# EAGLE design Placa de Cima (EAGLE 9.3.0)
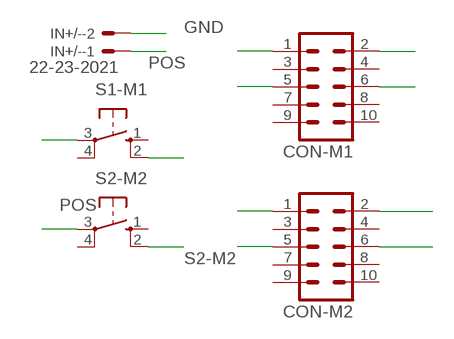
[diagram p0: schematic, sheet 1]

## Parts
CON-M1  MA05-2  [MA05-2]
CON-M2  MA05-2  [MA05-2]
IN+/-  22-23-2021  [22-23-2021]
S1-M1  10-XX  [B3F-10XX]
S2-M2  10-XX  [B3F-10XX]

## Nets
GND: CON-M1.5 CON-M1.6 CON-M2.5 CON-M2.6 IN+/-.2
POS: IN+/-.1 S1-M1.3(P) S2-M2.3(P)
S1-M1: CON-M1.1 CON-M1.2 S1-M1.2(S1)
S2-M2: CON-M2.1 CON-M2.2 S2-M2.2(S1)
Unconnected: CON-M1.3 CON-M1.4 CON-M1.7 CON-M1.8 CON-M1.9 CON-M1.10 CON-M2.3 CON-M2.4 CON-M2.7 CON-M2.8 CON-M2.9 CON-M2.10 S1-M1.1(S) S1-M1.4(P1) S2-M2.1(S) S2-M2.4(P1)

## Library data of the parts
CON-M1 CON-M2 = con-lstb:MA05-2: PIN HEADER; OC_FARNELL: unknown; OC_NEWARK: unknown
IN+/- = con-molex:22-23-2021: .100" (2.54mm) Center Header - 2 Pin; MF: MOLEX; MPN: 22-23-2021; OC_FARNELL: 1462926; OC_NEWARK: 25C3832
S1-M1 S2-M2 = switch-omron:10-XX: OMRON SWITCH; MPN: B3F-1000; OC_FARNELL: 176432; OC_NEWARK: 36M3542

## Board
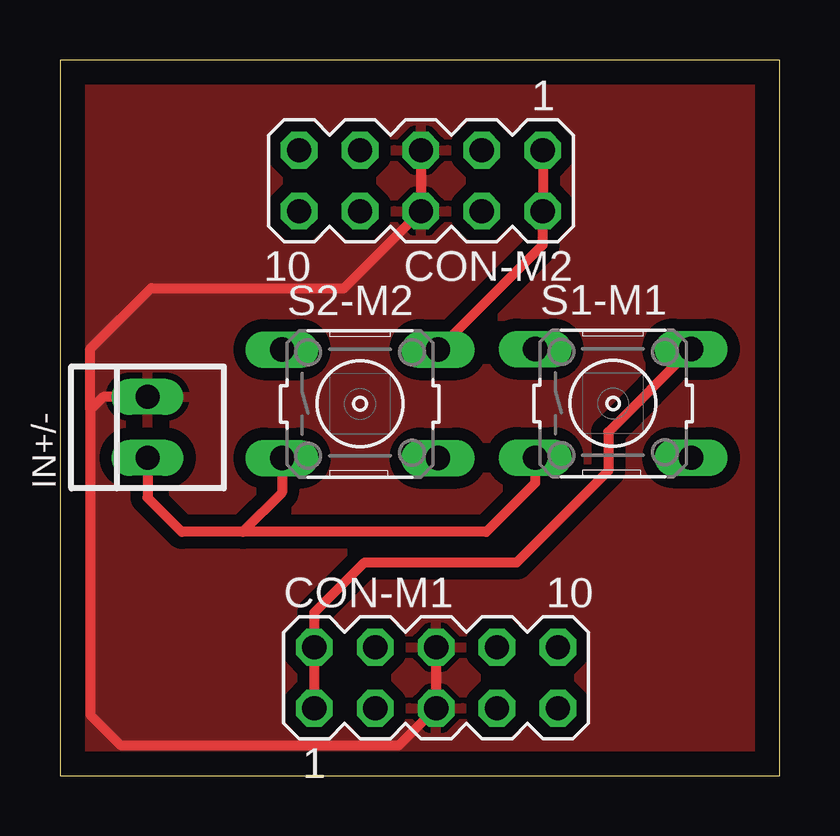
[diagram p1: board, top side]

Size 30 x 29.82 mm. Coordinates in mm from the lower left corner, seen from the top.
Outline: 0,0 30,0 30,29.82 0,29.82 0,0
Copper layers (1*16): Top 0.035mm / dielectric 1.5mm / Bottom 0.035mm
Design rules "default *": minimum track width 10mil, minimum drill 24mil, track to track 20mil, track to pad 20mil, pad to pad 20mil, via to via 20mil, smd to smd 20mil, copper to edge 40mil, drill to drill 8mil, minimum pad ring 10mil, minimum via ring 8mil, stop-mask expansion 4mil, vias tented up to drill 0mil, thermal gap 10mil

### Footprints (pad centres in the part's own frame; a part is rotated, then mirrored left to right if it is on the bottom)
MA05-2 = drill 1.016 octagon: 1 -5.08,-1.27; 2 -5.08,1.27; 3 -2.54,-1.27; 4 -2.54,1.27; 5 0,-1.27; 6 0,1.27; 7 2.54,-1.27; 8 2.54,1.27; 9 5.08,-1.27; 10 5.08,1.27
22-23-2021 = drill 1 long: 1 -1.27,0; 2 1.27,0
B3F-10XX = drill 1.016 long: 1 -3.251,2.261; 2 3.251,2.261; 3 -3.251,-2.261; 4 3.251,-2.261

### Placement (x,y rotation side)
CON-M1  15.68,4.08 0 top
CON-M2  15.05,24.79 180 top
IN+/-  3.65,14.51 90 top
S1-M1  23.06,15.51 0 top
S2-M2  12.51,15.49 0 top

### Tracks (layer width: path | path; a pad name or v marks a point on that pad's centre or on a via)
GND
  Top 0.406: IN+/-.2 1.81,15.78 1.27,15.24 | 1.27,15.24 1.27,2.54 2.54,1.27 14.14,1.27 CON-M1.5 CON-M1.6 | CON-M2.5 CON-M2.6 11.85,20.32 3.81,20.32 1.27,17.78 1.27,15.24
  pour Top: 0,0 0,29.21 29.21,29.21 30.48,27.94 30.48,0
POS
  Top 0.406: IN+/-.1 3.65,11.59 5.08,10.16 7.62,10.16 | S1-M1.3 19.81,12.19 17.78,10.16 7.62,10.16 | S2-M2.3 9.26,11.8 7.62,10.16
S1-M1
  Top 0.406: CON-M1.1 CON-M1.2 10.6,6.79 12.7,8.89 19.05,8.89 22.86,12.7 22.86,14.32 S1-M1.2
S2-M2
  Top 0.406: CON-M2.1 CON-M2.2 20.13,22.12 S2-M2.2